# EAGLE design main (EAGLE 9.6.2)
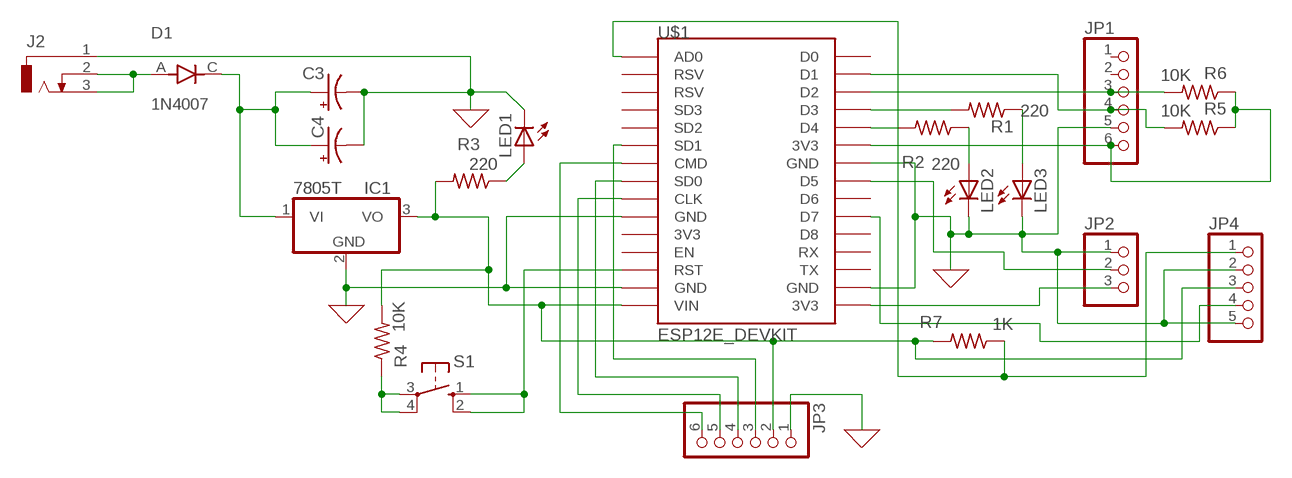
[diagram p0: schematic, sheet 1]

## Parts
C3  CPOL-USE2,5-6E  [E2,5-6E]
C4  CPOL-USE2,5-6E  [E2,5-6E]
D1  1N4007  [DIOAD1060W80L520D270]
IC1  7805T  [TO220H]
J2  DCJ0303  [DCJ0303]
JP1  PINHD-1X6  [1X06]
JP2  PINHD-1X3  [1X03]
JP3  PINHD-1X6  [1X06]
JP4  PINHD-1X55X2MM  [1_05X2MM]
LED1  LED3MM  [LED3MM]
LED2  LED3MM  [LED3MM]
LED3  LED3MM  [LED3MM]
R1  220  FLIPFLOP-RES  [0805-THM]
R2  220  FLIPFLOP-RES  [0805-THM]
R3  220  FLIPFLOP-RES  [0805-THM]
R4  10K  FLIPFLOP-RES  [0805-THM]
R5  10K  FLIPFLOP-RES  [0805-THM]
R6  10K  FLIPFLOP-RES  [0805-THM]
R7  1K  FLIPFLOP-RES  [0805-THM]
S1  10-XX  [B3F-10XX]
U$1  ESP12E_DEVKIT  [ESP12E_DEVKIT]

## Nets
0: C3.- C4.- IC1.2(GND) J2.1 JP1.5 JP2.1 JP3.1 JP4.2 JP4.5 LED1.K(C) LED2.K(C) LED3.K(C) U$1.GND@0(GND) U$1.GND@1(GND) U$1.GND@2(GND) U$1.GND@3(GND) ; supply symbol labelled GND
N$1: D1.A J2.2 J2.3
N$2: LED1.A R3.1
N$3: LED2.A R2.1
N$4: LED3.A R1.1
N$5: R1.2 U$1.D3
N$6: R2.2 U$1.D4
N$7: JP1.3 R6.2 U$1.D2
N$8: JP1.4 R5.2 U$1.D1
N$10: JP2.3 U$1.3V3@2(3V3)
N$11: S1.1(S) S1.2(S1) U$1.RST
N$12: JP2.2 U$1.D5
N$13: R4.1 S1.3(P) S1.4(P1)
N$14: JP1.6 R5.1 R6.1 U$1.3V3@1(3V3)
N$30: IC1.3(VO) JP3.2 JP4.3 R3.2 R4.2 R7.2 U$1.VIN
N$31: JP4.1 R7.1 U$1.AD0
N$32: JP4.4 U$1.D7
N$33: JP3.4 U$1.SD0
N$34: C3.+ C4.+ D1.C IC1.1(VI)
N$35: JP3.3 U$1.SD1
N$36: JP3.5 U$1.CLK
N$37: JP3.6 U$1.CMD
Unconnected: JP1.1 JP1.2 U$1.3V3@0(3V3) U$1.D0 U$1.D6 U$1.D8 U$1.EN U$1.RSV@0(RSV) U$1.RSV@1(RSV) U$1.RX U$1.SD2 U$1.SD3 U$1.TX

## Library data of the parts
C3 C4 = adafruit:CPOL-US: POLARIZED CAPACITOR, American symbol
D1 = 1N4007:1N4007: Diode Switching 1KV 1A 2-Pin DO-41; AVAILABILITY: Unavailable; DESCRIPTION: Diode Standard 1000V 1A Through Hole DO-41; MF: ON Semiconductor; MP: 1N4007; PACKAGE: DO-41-2 ON Semiconductor; PRICE: None
IC1 = adafruit:78*: Positive VOLTAGE REGULATOR Added bigger pads to the TO-92 package
J2 = con-jack:DCJ0303: DC POWER JACK Source: DCJ0303.pdf; OC_FARNELL: unknown; OC_NEWARK: unknown
JP1 JP3 = adafruit:PINHD-1X6: PIN HEADER
JP2 = adafruit:PINHD-1X3: PIN HEADER
JP4 = pinhead:PINHD-1X5: PIN HEADER
LED1-LED3 = adafruit:LED: LED OSRAM: - CHIPLED LG R971, LG N971, LY N971, LG Q971, LY Q971, LO R971, LY R971 LH N974, LH R974 LS Q976, LO Q976, LY Q976 LO Q996 - Hyper CHIPLED LW Q18S LB Q993, LB Q99A, LB R99A - SideLED LS A670, LO A670, LY A670, LG A670, LP A670 LB A673, LV A673, LT A673, LW A673 LH A674 LY A675 LS A676, LA A676, LO A676, LY A676, LW A676 LS A679, LY A679, LG A679 - Hyper Micro SIDELED® LS Y876, LA Y876, LO Y876, LY Y876 LT Y87S - SmartLED LW L88C, LW L88S LB L89C, LB L89S, LG L890 LS L89K, LO L89K, LY L89K LS L896, LA L896, LO L896, LY L896 - TOPLED LS T670, LO T670, LY T670, LG T670, LP T670 LSG T670, LSP T670, LSY T670, LOP T670, LYG T670 LG T671, LOG T671, LSG T671 LB T673, LV T673, LT T673, LW T673 LH T674 LS T676, LA T676, LO T676, LY T676, LB T676, LH T676, LSB T676, LW T676 LB T67C, LV T67C, LT T67C, LS T67K, LO T67K, LY T67K, LW E67C LS E67B, LA E67B, LO E67B, LY E67B, LB E67C, LV E67C, LT E67C LW T67C LS T679, LY T679, LG T679 LS T770, LO T770, LY T770, LG T770, LP T770 LB T773, LV T773, LT T773, LW T773 LH T774 LS E675, LA E675, LY E675, LS T675 LS T776, LA T776, LO T776, LY T776, LB T776 LHGB T686 LT T68C, LB T68C - Hyper Mini TOPLED® LB M676 - Mini TOPLED Santana® LG M470 LS M47K, LO M47K, LY M47K Source: http://www.osram.convergy.de/
R1-R7 = adafruit:FLIPFLOP-RES: Flip Flop resistor An 0805 resistor inside a standard 1/4W 5% resistor. Makes for easy mods
S1 = switch-omron:10-XX: OMRON SWITCH; MPN: B3F-1000; OC_FARNELL: 176432; OC_NEWARK: 36M3542
U$1 = ESP12E_DEVKIT:ESP12E_DEVKIT: ESP12E DEVKIT BOARD

## Board
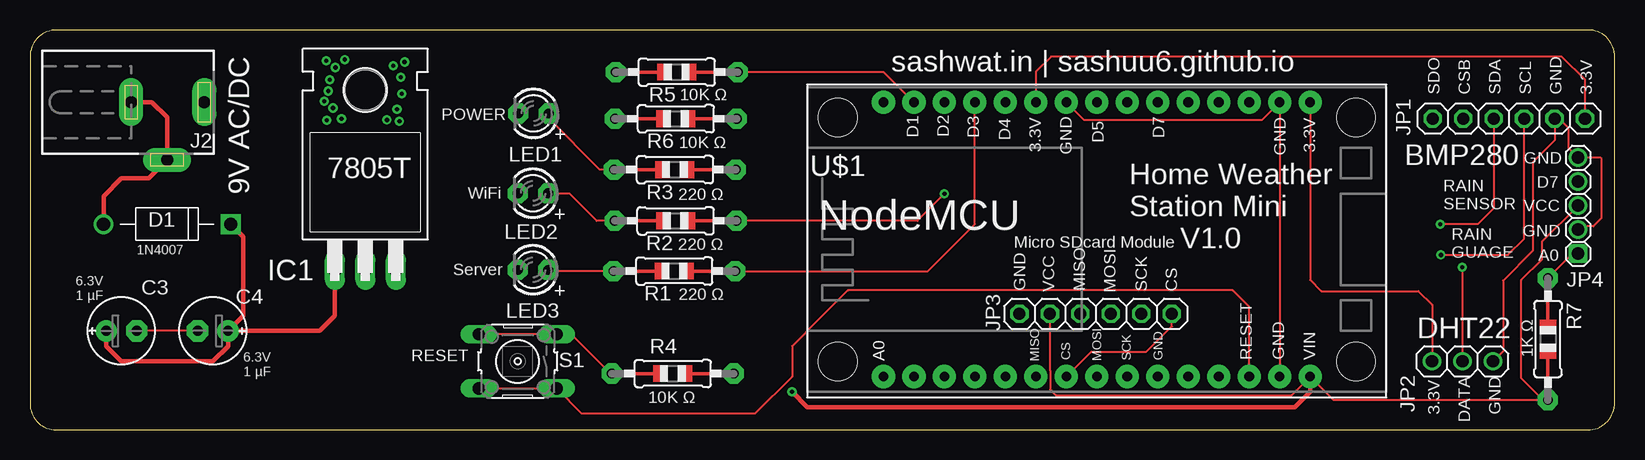
[diagram p1: board, top side]
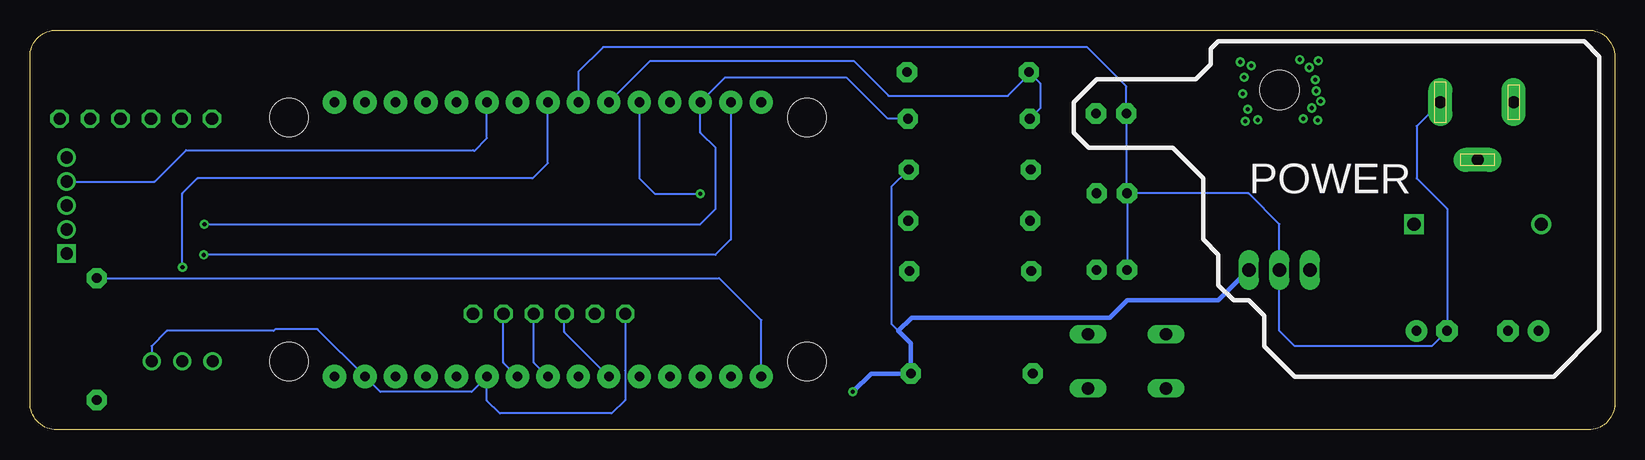
[diagram p2: board, bottom side, seen from below]

Size 132.06 x 33.33 mm. Coordinates in mm from the lower left corner, seen from the top.
Outline: 0,31.12 0,2.18 arc90 2.18,0 129.82,0 arc90 132.06,2.24 132.06,31.11 arc90 129.84,33.33 2.21,33.33 arc90 0,31.12
Copper layers (1*16): Top 0.035mm / dielectric 1.5mm / Bottom 0.035mm
Design rules "default": minimum track width 6mil, minimum drill 0.35mm, track to track 6mil, track to pad 6mil, pad to pad 6mil, via to via 6mil, smd to smd 6mil, copper to edge 40mil, drill to drill 6mil, minimum pad ring 10mil, minimum via ring 8mil, stop-mask expansion 4mil, vias tented up to drill 0mil, thermal gap 10mil

### Footprints (pad centres in the part's own frame; a part is rotated, then mirrored left to right if it is on the bottom)
E2,5-6E = drill 0.813 pad 1.778: + -1.27,0 | drill 0.813 pad 1.778 octagon: - 1.27,0
DIOAD1060W80L520D270 = drill 1.1 pad 1.65: A 5.3,0 | drill 1.1 pad 1.65 square: C -5.3,0
TO220H = drill 1.118 long: 1 -2.54,-10.16; 2 0,-10.16; 3 2.54,-10.16 | hole 3.302: 0,4.826
DCJ0303 = drill 1 pad 2 long: 1 0,3.1; 2 4.8,0; 3 0,-3
1X06 = drill 1.016 octagon: 1 -6.35,0; 2 -3.81,0; 3 -1.27,0; 4 1.27,0; 5 3.81,0; 6 6.35,0
1X03 = drill 1.016: 1 -2.54,0; 2 0,0; 3 2.54,0
1_05X2MM = drill 1.016 pad 1.3 square: 1 -4,0 | drill 1.016 pad 1.3: 2 -2,0; 3 0,0; 4 2,0; 5 4,0
LED3MM = drill 0.813 pad 1.676 octagon: A -1.27,0; K 1.27,0
0805-THM = drill 0.813 pad 1.676 octagon: 1 -5.08,0; 2 5.08,0
B3F-10XX = drill 1.016 long: 1 -3.251,2.261; 2 3.251,2.261; 3 -3.251,-2.261; 4 3.251,-2.261
ESP12E_DEVKIT = drill 0.8 pad 1.93: 3V3@0 -11.43,-7.62; 3V3@1 11.43,5.08; 3V3@2 11.43,-17.78; AD0 -11.43,17.78; CLK -11.43,-2.54; CMD -11.43,2.54; D0 11.43,17.78; D1 11.43,15.24; D2 11.43,12.7; D3 11.43,10.16; D4 11.43,7.62; D5 11.43,0; D6 11.43,-2.54; D7 11.43,-5.08; D8 11.43,-7.62; EN -11.43,-10.16; GND@0 -11.43,-5.08; GND@1 -11.43,-15.24; GND@2 11.43,2.54; GND@3 11.43,-15.24; RST -11.43,-12.7; RSV@0 -11.43,15.24; RSV@1 -11.43,12.7; RX 11.43,-10.16; SD0 -11.43,0; SD1 -11.43,5.08; SD2 -11.43,7.62; SD3 -11.43,10.16; TX 11.43,-12.7; VIN -11.43,-17.78 | hole 3.2: -10.16,21.59; 10.16,21.59; 10.16,-21.59; -10.16,-21.59

### Placement (x,y rotation side)
C3  7.62,8.25 0 top
C4  15.24,8.25 180 top
D1  11.43,17.14 180 top
IC1  27.94,23.5 0 top
J2  11.43,27.3 270 top
JP1  123.24,25.93 0 top
JP2  119.38,5.72 180 top
JP3  88.8,9.68 0 top
JP4  129.01,18.69 90 top
LED1  41.96,26.37 180 top
LED2  41.91,19.71 180 top
LED3  41.91,13.34 180 top
R1  53.7,13.23 0 top
R2  53.8,17.42 0 top
R3  53.75,21.69 0 top
R4  53.57,4.7 0 top
R5  53.9,29.82 0 top
R6  53.82,25.93 0 top
R7  126.49,7.57 270 top
S1  40.64,5.72 180 top
U$1  88.9,15.88 90 top

### Tracks (layer width: path | path; a pad name or v marks a point on that pad's centre or on a via)
0
  Top 0.152: C4.- C3.- | U$1.GND@1 U$1.GND@3 102.69,25.86 87.81,25.86 U$1.GND@2 | JP4.2 129.28,16.97 130.28,16.97 130.97,17.66 130.97,22.57 130.85,22.69 JP4.5 128.22,23.48 128.22,25.15 127.43,25.93 JP1.5 127.05,24.13 125.22,22.3 125.22,14.91 122.76,12.45 122.76,6.55 JP2.1
  Bottom 0.152: J2.1 16.51,25.32 16.51,20.96 13.97,18.41 C4.- 15.24,6.99 26.67,6.99 27.94,8.25 IC1.2 27.94,17.14 30.5,19.71 LED2.K | LED2.K 40.69,19.76 LED1.K 40.69,28.63 43.97,31.9 84.3,31.9 86.36,29.84 U$1.GND@2 | LED2.K LED3.K | JP2.1 121.92,6.99 120.65,8.25 111.76,8.25 111.61,8.41 108.1,8.41 U$1.GND@1 102.87,3.17 95.25,3.17 U$1.GND@0 93.98,2.44 92.91,1.37 83.59,1.37 82.47,2.49 82.47,4.94 82.45,4.96 JP3.1
N$1
  Top 0.356: J2.3 10.16,27.3 11.43,26.04 J2.2 9.88,20.96 7.62,20.96 6.13,19.46 D1.A
N$2
  Top 0.152: R3.1 47.5,21.69 43.23,25.96 LED1.A
N$3
  Top 0.152: LED2.A 44.93,19.71 47.22,17.42 R2.1
N$4
  Top 0.152: R1.1 43.28,13.23 LED3.A
N$5
  Top 0.152: R1.2 74.83,13.23 78.74,17.14 U$1.D3
N$6  (via drill 0.35)
  Top 0.152: R2.2 73.94,17.42 v76.2,19.69
  Bottom 0.152: v76.2,19.69 80.01,19.69 81.28,20.96 U$1.D4
N$7  (via drill 0.35)
  Top 0.152: JP1.3 121.97,18.47 120.65,17.14 v117.53,17.14
  Bottom 0.152: v117.53,17.14 76.2,17.14 74.93,18.41 74.93,23.5 76.2,24.77 U$1.D2 74.17,29.34 63.98,29.34 60.58,25.93 R6.2
N$8  (via drill 0.35)
  Top 0.152: v117.58,14.58 123.16,14.58 124.51,15.93 JP1.4 | U$1.D1 71.14,29.82 R5.2
  Bottom 0.152: U$1.D1 73.66,15.88 74.95,14.58 v117.58,14.58
N$9  (via drill 0.35)
  other vias: 24.69,30.76
N$10
  Top 0.152: U$1.3V3@2 106.68,12.5 107.62,11.56 115.7,11.56 116.84,10.41 JP2.3
N$11
  Top 0.152: S1.2 S1.1 46,1.35 60.4,1.35 63.5,4.45 63.5,6.99 65.79,9.27 68.15,11.63 100.23,11.63 101.6,10.26 U$1.RST
N$12  (via drill 0.35)
  Top 0.152: v119.36,13.56 119.36,5.74 JP2.2
  Bottom 0.152: v119.36,13.56 119.36,19.71 118.11,20.96 90.17,20.96 88.9,22.23 U$1.D5
N$13
  Top 0.152: R4.1 48.39,4.7 45.11,7.98 S1.3 S1.4
N$14
  Top 0.152: U$1.3V3@1 83.82,29.84 85.09,31.12 127.63,31.12 129.59,29.16 JP1.6
  Bottom 0.152: U$1.3V3@1 80.37,30.76 63.42,30.76 60.5,27.84 50.57,27.84 48.82,29.59 R5.1 47.88,28.88 47.88,26.8 R6.1
N$15  (via drill 0.35)
  other vias: 31.22,30.66
N$16  (via drill 0.35)
  other vias: 25.45,30.2
N$17  (via drill 0.35)
  other vias: 24.97,29.18
N$18  (via drill 0.35)
  other vias: 24.87,28.24
N$19  (via drill 0.35)
  other vias: 25.25,26.82
N$20  (via drill 0.35)
  other vias: 30.28,30.35
N$21  (via drill 0.35)
  other vias: 30.89,29.39
N$22  (via drill 0.35)
  other vias: 30.99,28.02
N$23  (via drill 0.35)
  other vias: 30.58,26.72
N$24  (via drill 0.35)
  other vias: 25.96,25.93
N$25  (via drill 0.35)
  other vias: 29.74,25.83
N$26  (via drill 0.35)
  other vias: 30.78,25.73
N$27  (via drill 0.35)
  other vias: 24.74,25.81
N$28  (via drill 0.35)
  other vias: 24.51,27.38
N$29  (via drill 0.35)
  other vias: 26.24,30.86
N$30  (via drill 0.35)
  Top 0.152: 106.68,4.06 U$1.VIN | JP4.3 125.98,15.67 125.98,14.2 124.28,12.5 124.26,12.5 124.23,12.47 124.23,4.34 126.09,2.49 R7.2 108.64,2.49 U$1.VIN | JP3.2 84.99,4.96 85.01,4.94 85.01,3.38 85.5,2.9 105.13,2.9 U$1.VIN
  Top 0.356: U$1.VIN 106.68,3.17 105.41,1.91 64.77,1.91 v63.5,3.17
  Bottom 0.152: R3.2 60.27,20.24 60.27,8.84 59.69,8.25
  Bottom 0.356: v63.5,3.17 61.98,4.7 R4.2 58.65,7.21 59.69,8.25 58.6,9.35 42.09,9.35 40.64,10.8 33.02,10.8 IC1.3
N$31
  Top 0.152: JP4.1 128.54,14.69 R7.1
  Bottom 0.152: U$1.AD0 71.12,9.14 72.99,11.01 73.05,11.07 74.62,12.65 R7.1
N$32
  Bottom 0.152: JP4.4 121.67,20.69 119.05,23.32 95.12,23.32 95.05,23.24 93.98,24.31 U$1.D7
N$33
  Bottom 0.152: U$1.SD0 90.07,5.61 JP3.4
N$34
  Top 0.356: D1.C 17.78,16.1 17.78,9.52 C4.+ | C3.+ 6.35,6.99 7.62,5.72 15.24,5.72 16.51,6.99 C4.+ | C4.+ 24.13,8.25 25.4,9.52 IC1.1
N$35
  Bottom 0.152: U$1.SD1 87.53,8.15 JP3.3
N$36
  Bottom 0.152: U$1.CLK 92.61,5.61 JP3.5
N$37
  Top 0.152: U$1.CMD 88.44,6.53 93.04,6.53 95.15,8.64 JP3.6

### Text on the board
tPlace: 9V AC/DC | sashwat.in | sashuu6.github.io | 10K Ω | SDO | CSB | SDA | SCL | GND | 3.3V | POWER | D1 | D2 | D3 | D4 | D7 | 10K Ω | 3.3V | D5 | 3.3V | GND | GND | BMP280 | GND | 7805T | D7 | WiFi | 220 Ω | RAIN / SENSOR | VCC | NodeMCU | GND | 220 Ω | Micro SDcard Module | Home Weather / Station Mini / V1.0 | 1N4007 | RAIN / GUAGE | A0 | Server | GND | VCC | MISO | MOSI | SCK | CS | 6.3V / 1 µF | 220 Ω | DHT22 | 1K Ω | RESET | A0 | MISO | CS | MOSI | SCK | GND | RESET | GND | VIN | 6.3V / 1 µF | 10K Ω | 3.3V | GND | DATA
bPlace: POWER